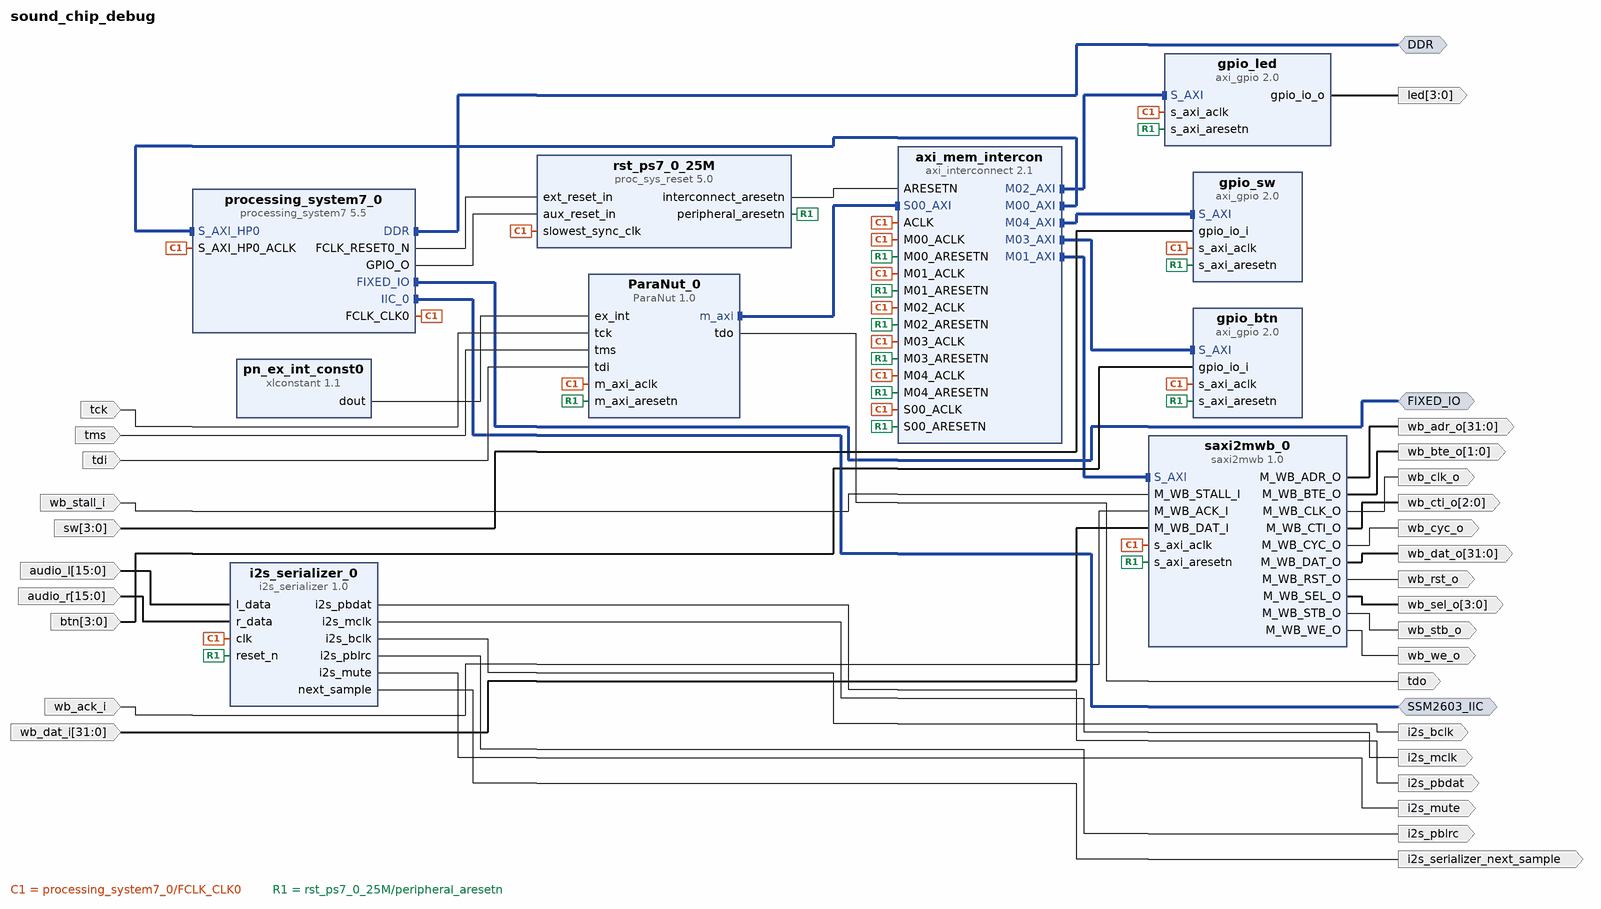
[diagram p0: block diagram of the top level]
# Vivado block design sound_chip_debug, xc7z010clg400-1, Vivado 2019.1
create_bd_design sound_chip_debug

create_bd_intf_port -mode Master -vlnv xilinx.com:interface:ddrx_rtl:1.0 DDR
create_bd_intf_port -mode Master -vlnv xilinx.com:display_processing_system7:fixedio_rtl:1.0 FIXED_IO
create_bd_intf_port -mode Master -vlnv xilinx.com:interface:iic_rtl:1.0 SSM2603_IIC
create_bd_port -dir I wb_stall_i
create_bd_port -dir I wb_ack_i
create_bd_port -dir I -from 31 -to 0 wb_dat_i
create_bd_port -dir O wb_cyc_o
create_bd_port -dir O -from 3 -to 0 wb_sel_o
create_bd_port -dir O wb_we_o
create_bd_port -dir O -from 31 -to 0 wb_adr_o
create_bd_port -dir O wb_clk_o
create_bd_port -dir O wb_rst_o
create_bd_port -dir O -from 2 -to 0 wb_cti_o
create_bd_port -dir O -from 1 -to 0 wb_bte_o
create_bd_port -dir O wb_stb_o
create_bd_port -dir O -from 31 -to 0 wb_dat_o
create_bd_port -dir I -from 15 -to 0 audio_l
create_bd_port -dir I -from 15 -to 0 audio_r
create_bd_port -dir O i2s_pbdat
create_bd_port -dir O i2s_pblrc
create_bd_port -dir O i2s_mclk
create_bd_port -dir O i2s_bclk
create_bd_port -dir O i2s_mute
create_bd_port -dir I tck
create_bd_port -dir I tms
create_bd_port -dir I tdi
create_bd_port -dir O tdo
create_bd_port -dir O i2s_serializer_next_sample
create_bd_port -dir I -from 3 -to 0 btn
create_bd_port -dir I -from 3 -to 0 sw
create_bd_port -dir O -from 3 -to 0 led

create_bd_cell -type ip -vlnv xilinx.com:ip:processing_system7:5.5 processing_system7_0
set_property -dict [list \
  CONFIG.PCW_APU_PERIPHERAL_FREQMHZ 650 \
  CONFIG.PCW_CRYSTAL_PERIPHERAL_FREQMHZ 50.000000 \
  CONFIG.PCW_ENET0_ENET0_IO {MIO 16 .. 27} \
  CONFIG.PCW_ENET0_GRP_MDIO_ENABLE 1 \
  CONFIG.PCW_ENET0_GRP_MDIO_IO {MIO 52 .. 53} \
  CONFIG.PCW_ENET0_PERIPHERAL_ENABLE 1 \
  CONFIG.PCW_ENET0_RESET_ENABLE 0 \
  CONFIG.PCW_ENET_RESET_ENABLE 1 \
  CONFIG.PCW_ENET_RESET_SELECT {Share reset pin} \
  CONFIG.PCW_FPGA0_PERIPHERAL_FREQMHZ 25 \
  CONFIG.PCW_FPGA1_PERIPHERAL_FREQMHZ 50 \
  CONFIG.PCW_GP0_EN_MODIFIABLE_TXN 0 \
  CONFIG.PCW_GP1_EN_MODIFIABLE_TXN 0 \
  CONFIG.PCW_GPIO_EMIO_GPIO_ENABLE 1 \
  CONFIG.PCW_GPIO_EMIO_GPIO_IO 1 \
  CONFIG.PCW_GPIO_EMIO_GPIO_WIDTH 1 \
  CONFIG.PCW_GPIO_MIO_GPIO_ENABLE 1 \
  CONFIG.PCW_GPIO_MIO_GPIO_IO MIO \
  CONFIG.PCW_I2C0_I2C0_IO EMIO \
  CONFIG.PCW_I2C0_PERIPHERAL_ENABLE 1 \
  CONFIG.PCW_I2C_PERIPHERAL_FREQMHZ 108.333336 \
  CONFIG.PCW_I2C_RESET_ENABLE 1 \
  CONFIG.PCW_I2C_RESET_SELECT {Share reset pin} \
  CONFIG.PCW_PERIPHERAL_BOARD_PRESET part0 \
  CONFIG.PCW_PRESET_BANK1_VOLTAGE {LVCMOS 1.8V} \
  CONFIG.PCW_QSPI_GRP_FBCLK_ENABLE 1 \
  CONFIG.PCW_QSPI_GRP_FBCLK_IO {MIO 8} \
  CONFIG.PCW_QSPI_GRP_SINGLE_SS_ENABLE 1 \
  CONFIG.PCW_QSPI_GRP_SINGLE_SS_IO {MIO 1 .. 6} \
  CONFIG.PCW_QSPI_PERIPHERAL_ENABLE 1 \
  CONFIG.PCW_QSPI_QSPI_IO {MIO 1 .. 6} \
  CONFIG.PCW_SD0_GRP_CD_ENABLE 1 \
  CONFIG.PCW_SD0_GRP_CD_IO {MIO 47} \
  CONFIG.PCW_SD0_GRP_WP_ENABLE 1 \
  CONFIG.PCW_SD0_GRP_WP_IO EMIO \
  CONFIG.PCW_SD0_PERIPHERAL_ENABLE 1 \
  CONFIG.PCW_SD0_SD0_IO {MIO 40 .. 45} \
  CONFIG.PCW_SDIO_PERIPHERAL_FREQMHZ 50 \
  CONFIG.PCW_SINGLE_QSPI_DATA_MODE x4 \
  CONFIG.PCW_TTC0_PERIPHERAL_ENABLE 1 \
  CONFIG.PCW_TTC0_TTC0_IO EMIO \
  CONFIG.PCW_UART1_PERIPHERAL_ENABLE 1 \
  CONFIG.PCW_UART1_UART1_IO {MIO 48 .. 49} \
  CONFIG.PCW_UART_PERIPHERAL_FREQMHZ 100 \
  CONFIG.PCW_UIPARAM_DDR_FREQ_MHZ 525 \
  CONFIG.PCW_UIPARAM_DDR_PARTNO {MT41K128M16 JT-125} \
  CONFIG.PCW_USB0_PERIPHERAL_ENABLE 1 \
  CONFIG.PCW_USB0_RESET_ENABLE 1 \
  CONFIG.PCW_USB0_RESET_IO {MIO 46} \
  CONFIG.PCW_USB0_USB0_IO {MIO 28 .. 39} \
  CONFIG.PCW_USB_RESET_ENABLE 1 \
  CONFIG.PCW_USB_RESET_SELECT {Share reset pin} \
  CONFIG.PCW_USE_M_AXI_GP0 0 \
  CONFIG.PCW_USE_S_AXI_HP0 1 \
] [get_bd_cells processing_system7_0]
# 493 more settings of processing_system7_0 are not shown: defaults, MIO pin electricals, DDR timing, and values the tool derives
create_bd_cell -type ip -vlnv ees.hs-augsburg.de:user:saxi2mwb:1.0 saxi2mwb_0
create_bd_cell -type ip -vlnv xilinx.com:ip:axi_interconnect:2.1 axi_mem_intercon
set_property -dict {CONFIG.NUM_MI 5} [get_bd_cells axi_mem_intercon]
create_bd_cell -type ip -vlnv xilinx.com:ip:proc_sys_reset:5.0 rst_ps7_0_25M
set_property -dict {CONFIG.C_AUX_RESET_HIGH 0} [get_bd_cells rst_ps7_0_25M]
create_bd_cell -type ip -vlnv xilinx.com:ip:xlconstant:1.1 pn_ex_int_const0
set_property -dict {CONFIG.CONST_VAL 0 CONFIG.CONST_WIDTH 2} [get_bd_cells pn_ex_int_const0]
create_bd_cell -type ip -vlnv ees.hs-augsburg.de:user:ParaNut:1.0 ParaNut_0
set_property -dict {CONFIG.C_M_AXI_ACLK_FREQ_HZ 25000000} [get_bd_cells ParaNut_0]
create_bd_cell -type ip -vlnv ees.hs-augsburg.de:user:i2s_serializer:1.0 i2s_serializer_0
create_bd_cell -type ip -vlnv xilinx.com:ip:axi_gpio:2.0 gpio_led
set_property -dict {CONFIG.C_ALL_OUTPUTS 1 CONFIG.C_GPIO_WIDTH 4} [get_bd_cells gpio_led]
create_bd_cell -type ip -vlnv xilinx.com:ip:axi_gpio:2.0 gpio_btn
set_property -dict {CONFIG.C_ALL_INPUTS 1 CONFIG.C_GPIO_WIDTH 4} [get_bd_cells gpio_btn]
create_bd_cell -type ip -vlnv xilinx.com:ip:axi_gpio:2.0 gpio_sw
set_property -dict {CONFIG.C_ALL_INPUTS 1 CONFIG.C_GPIO_WIDTH 4} [get_bd_cells gpio_sw]

# ---- connections ----

connect_bd_intf_net [get_bd_intf_pins axi_mem_intercon/M00_AXI] [get_bd_intf_pins processing_system7_0/S_AXI_HP0]
connect_bd_intf_net [get_bd_intf_ports SSM2603_IIC] [get_bd_intf_pins processing_system7_0/IIC_0]
connect_bd_intf_net [get_bd_intf_ports DDR] [get_bd_intf_pins processing_system7_0/DDR]
connect_bd_intf_net [get_bd_intf_ports FIXED_IO] [get_bd_intf_pins processing_system7_0/FIXED_IO]
connect_bd_intf_net [get_bd_intf_pins axi_mem_intercon/M01_AXI] [get_bd_intf_pins saxi2mwb_0/S_AXI]
connect_bd_intf_net [get_bd_intf_pins axi_mem_intercon/M03_AXI] [get_bd_intf_pins gpio_btn/S_AXI]
connect_bd_intf_net [get_bd_intf_pins axi_mem_intercon/M04_AXI] [get_bd_intf_pins gpio_sw/S_AXI]
connect_bd_intf_net [get_bd_intf_pins axi_mem_intercon/M02_AXI] [get_bd_intf_pins gpio_led/S_AXI]
connect_bd_intf_net [get_bd_intf_pins ParaNut_0/m_axi] [get_bd_intf_pins axi_mem_intercon/S00_AXI]
connect_bd_net [get_bd_pins processing_system7_0/FCLK_CLK0] \
  [get_bd_pins axi_mem_intercon/S00_ACLK] [get_bd_pins rst_ps7_0_25M/slowest_sync_clk] \
  [get_bd_pins processing_system7_0/S_AXI_HP0_ACLK] [get_bd_pins axi_mem_intercon/M00_ACLK] \
  [get_bd_pins axi_mem_intercon/ACLK] [get_bd_pins saxi2mwb_0/s_axi_aclk] [get_bd_pins axi_mem_intercon/M01_ACLK] \
  [get_bd_pins ParaNut_0/m_axi_aclk] [get_bd_pins i2s_serializer_0/clk] [get_bd_pins gpio_led/s_axi_aclk] \
  [get_bd_pins axi_mem_intercon/M02_ACLK] [get_bd_pins gpio_btn/s_axi_aclk] [get_bd_pins axi_mem_intercon/M03_ACLK] \
  [get_bd_pins gpio_sw/s_axi_aclk] [get_bd_pins axi_mem_intercon/M04_ACLK]
connect_bd_net [get_bd_pins processing_system7_0/FCLK_RESET0_N] [get_bd_pins rst_ps7_0_25M/ext_reset_in]
connect_bd_net [get_bd_pins rst_ps7_0_25M/peripheral_aresetn] \
  [get_bd_pins axi_mem_intercon/S00_ARESETN] [get_bd_pins axi_mem_intercon/M00_ARESETN] \
  [get_bd_pins saxi2mwb_0/s_axi_aresetn] [get_bd_pins axi_mem_intercon/M01_ARESETN] [get_bd_pins ParaNut_0/m_axi_aresetn] \
  [get_bd_pins i2s_serializer_0/reset_n] [get_bd_pins gpio_led/s_axi_aresetn] [get_bd_pins axi_mem_intercon/M02_ARESETN] \
  [get_bd_pins gpio_btn/s_axi_aresetn] [get_bd_pins axi_mem_intercon/M03_ARESETN] [get_bd_pins gpio_sw/s_axi_aresetn] \
  [get_bd_pins axi_mem_intercon/M04_ARESETN]
connect_bd_net [get_bd_pins rst_ps7_0_25M/interconnect_aresetn] [get_bd_pins axi_mem_intercon/ARESETN]
connect_bd_net -net M_WB_STALL_I_0_1 [get_bd_ports wb_stall_i] [get_bd_pins saxi2mwb_0/M_WB_STALL_I]
connect_bd_net -net M_WB_ACK_I_0_1 [get_bd_ports wb_ack_i] [get_bd_pins saxi2mwb_0/M_WB_ACK_I]
connect_bd_net -net M_WB_DAT_I_0_1 [get_bd_ports wb_dat_i] [get_bd_pins saxi2mwb_0/M_WB_DAT_I]
connect_bd_net [get_bd_pins saxi2mwb_0/M_WB_CYC_O] [get_bd_ports wb_cyc_o]
connect_bd_net [get_bd_pins saxi2mwb_0/M_WB_SEL_O] [get_bd_ports wb_sel_o]
connect_bd_net [get_bd_pins saxi2mwb_0/M_WB_WE_O] [get_bd_ports wb_we_o]
connect_bd_net [get_bd_pins saxi2mwb_0/M_WB_ADR_O] [get_bd_ports wb_adr_o]
connect_bd_net [get_bd_pins saxi2mwb_0/M_WB_CLK_O] [get_bd_ports wb_clk_o]
connect_bd_net [get_bd_pins saxi2mwb_0/M_WB_RST_O] [get_bd_ports wb_rst_o]
connect_bd_net [get_bd_pins saxi2mwb_0/M_WB_CTI_O] [get_bd_ports wb_cti_o]
connect_bd_net [get_bd_pins saxi2mwb_0/M_WB_BTE_O] [get_bd_ports wb_bte_o]
connect_bd_net [get_bd_pins saxi2mwb_0/M_WB_STB_O] [get_bd_ports wb_stb_o]
connect_bd_net [get_bd_pins saxi2mwb_0/M_WB_DAT_O] [get_bd_ports wb_dat_o]
connect_bd_net -net l_data_0_1 [get_bd_ports audio_l] [get_bd_pins i2s_serializer_0/l_data]
connect_bd_net -net r_data_0_1 [get_bd_ports audio_r] [get_bd_pins i2s_serializer_0/r_data]
connect_bd_net [get_bd_pins i2s_serializer_0/i2s_pbdat] [get_bd_ports i2s_pbdat]
connect_bd_net [get_bd_pins i2s_serializer_0/i2s_pblrc] [get_bd_ports i2s_pblrc]
connect_bd_net [get_bd_pins i2s_serializer_0/i2s_mclk] [get_bd_ports i2s_mclk]
connect_bd_net [get_bd_pins i2s_serializer_0/i2s_bclk] [get_bd_ports i2s_bclk]
connect_bd_net [get_bd_pins i2s_serializer_0/i2s_mute] [get_bd_ports i2s_mute]
connect_bd_net -net tck_0_1 [get_bd_ports tck] [get_bd_pins ParaNut_0/tck]
connect_bd_net -net tms_0_1 [get_bd_ports tms] [get_bd_pins ParaNut_0/tms]
connect_bd_net -net tdi_0_1 [get_bd_ports tdi] [get_bd_pins ParaNut_0/tdi]
connect_bd_net [get_bd_pins ParaNut_0/tdo] [get_bd_ports tdo]
connect_bd_net [get_bd_pins processing_system7_0/GPIO_O] [get_bd_pins rst_ps7_0_25M/aux_reset_in]
connect_bd_net [get_bd_pins i2s_serializer_0/next_sample] [get_bd_ports i2s_serializer_next_sample]
connect_bd_net [get_bd_pins pn_ex_int_const0/dout] [get_bd_pins ParaNut_0/ex_int]
connect_bd_net -net gpio_io_i_0_1 [get_bd_ports btn] [get_bd_pins gpio_btn/gpio_io_i]
connect_bd_net -net gpio_io_i_0_2 [get_bd_ports sw] [get_bd_pins gpio_sw/gpio_io_i]
connect_bd_net [get_bd_pins gpio_led/gpio_io_o] [get_bd_ports led]

# ---- address map ----
assign_bd_address -offset 0x00000000 -range 512M -target_address_space [get_bd_addr_spaces ParaNut_0/m_axi] [get_bd_addr_segs processing_system7_0/S_AXI_HP0/HP0_DDR_LOWOCM]
assign_bd_address -offset 0x40000000 -range 64K -target_address_space [get_bd_addr_spaces ParaNut_0/m_axi] [get_bd_addr_segs gpio_led/S_AXI/Reg]
assign_bd_address -offset 0x40010000 -range 64K -target_address_space [get_bd_addr_spaces ParaNut_0/m_axi] [get_bd_addr_segs gpio_btn/S_AXI/Reg]
assign_bd_address -offset 0x40020000 -range 64K -target_address_space [get_bd_addr_spaces ParaNut_0/m_axi] [get_bd_addr_segs gpio_sw/S_AXI/Reg]
assign_bd_address -offset 0x76000000 -range 64K -target_address_space [get_bd_addr_spaces ParaNut_0/m_axi] [get_bd_addr_segs saxi2mwb_0/S_AXI/S_AXI_mem]

validate_bd_design
save_bd_design
